# EAGLE design Adafruit PiTFT 2.8inch Resistive PCB (EAGLE 6.3)
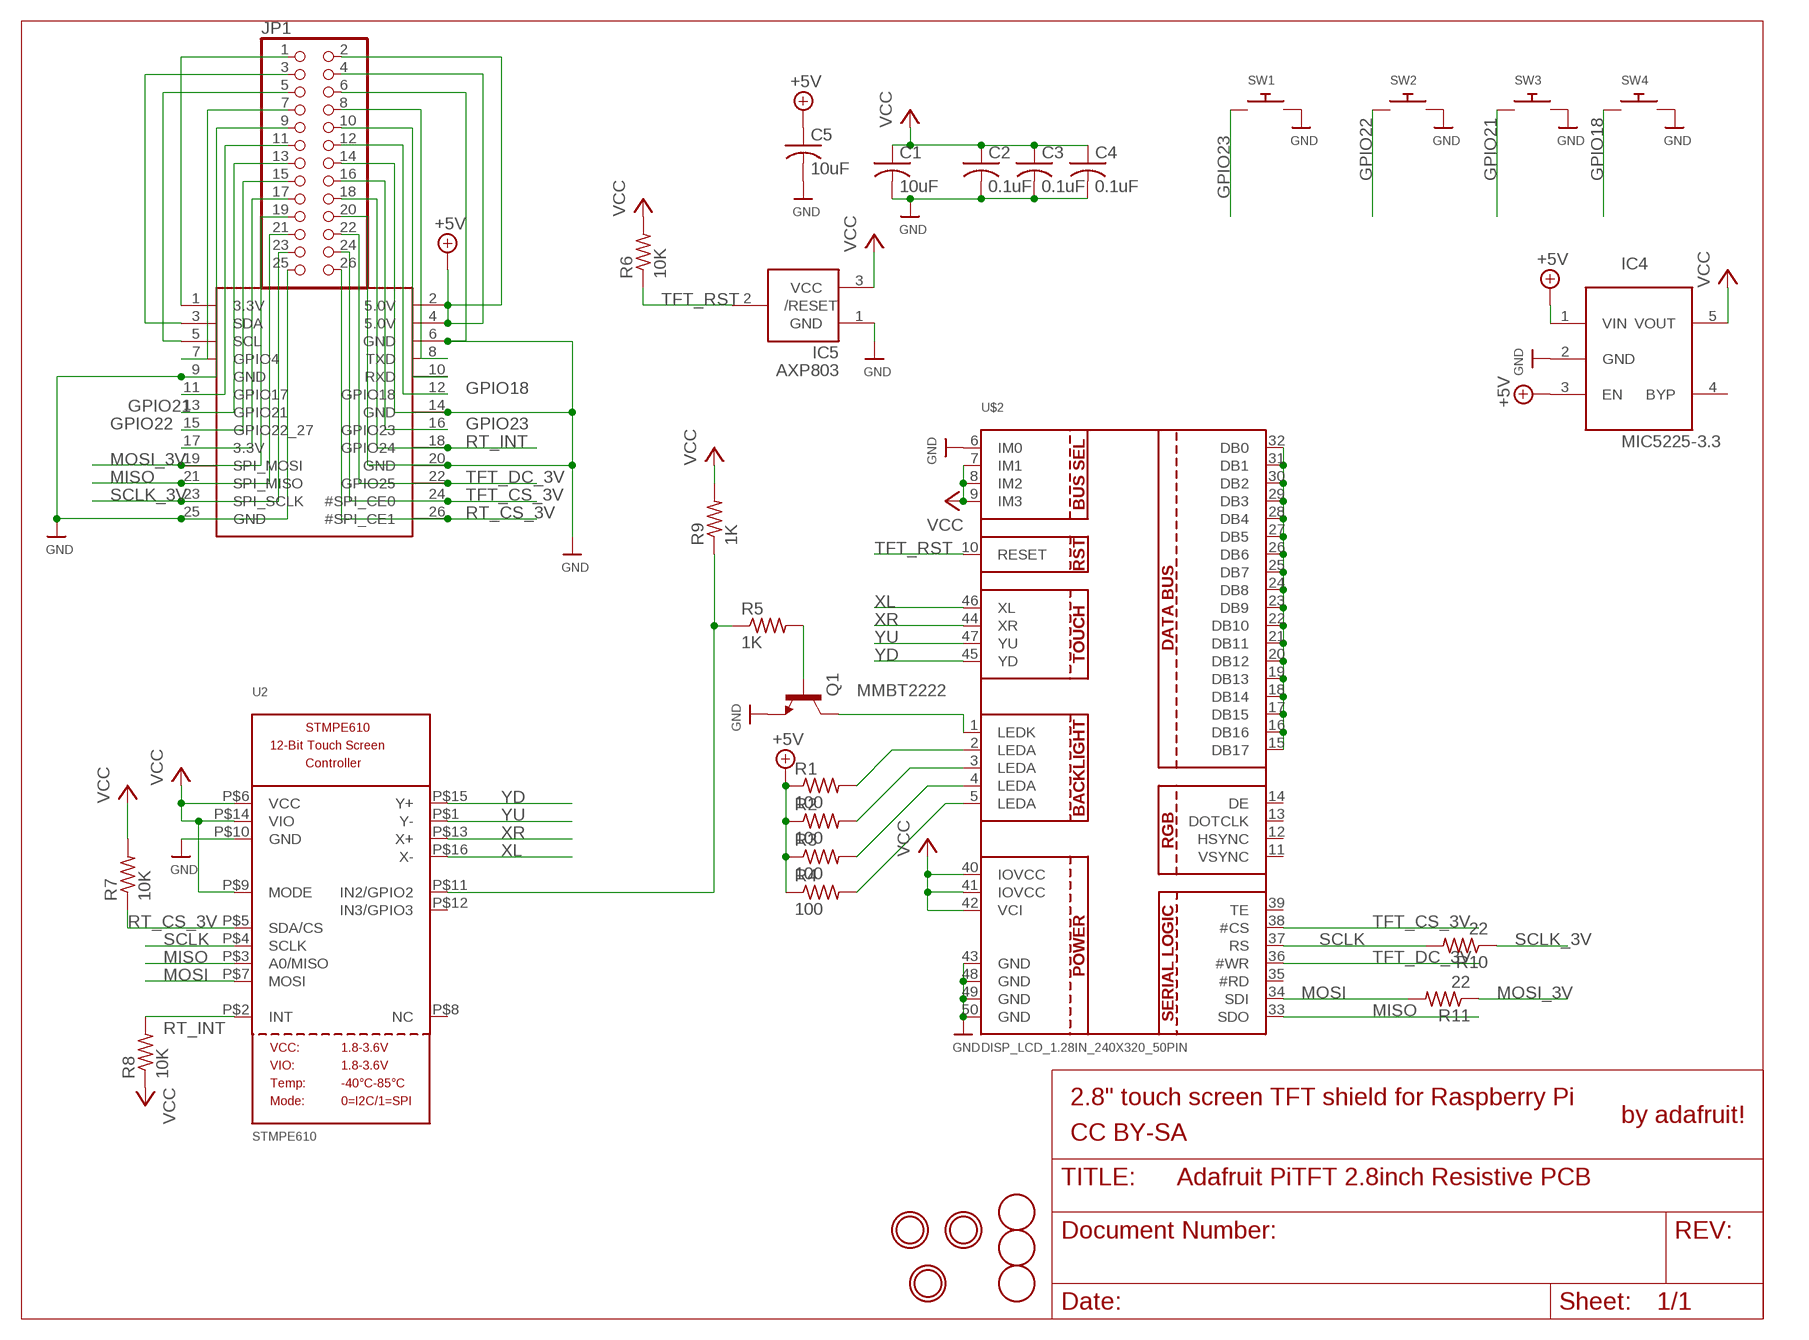
[diagram p0: schematic, sheet 1]

## Parts
C1  10uF  C-USC0805K  [C0805K]
C2  0.1uF  C-USC0805K  [C0805K]
C3  0.1uF  C-USC0805K  [C0805K]
C4  0.1uF  C-USC0805K  [C0805K]
C5  10uF  C-USC0805K  [C0805K]
IC4  MIC5225-3.3  LP298XS  [SOT23-5L]
IC5  AXP803  AXP083-SAG  [SOT23]
JP1  HEADER-2X13  [2X13]
Q1  MMBT2222  MMBT2222ALT1-NPN-SOT23-BEC  [SOT23-BEC]
R1  100  R-US_R0805  [R0805]
R2  100  R-US_R0805  [R0805]
R3  100  R-US_R0805  [R0805]
R4  100  R-US_R0805  [R0805]
R5  1K  R-US_R0805  [R0805]
R6  10K  R-US_R0805  [R0805]
R7  10K  R-US_R0805  [R0805]
R8  10K  R-US_R0805  [R0805]
R9  1K  R-US_R0805  [R0805]
R10  22  R-US_R0805  [R0805]
R11  22  R-US_R0805  [R0805]
SW1  SWITCH_PUSHBUTTONEVQ-PE  [TACT_PANA-EVQ]
SW2  SWITCH_PUSHBUTTONEVQ-PE  [TACT_PANA-EVQ]
SW3  SWITCH_PUSHBUTTONEVQ-PE  [TACT_PANA-EVQ]
SW4  SWITCH_PUSHBUTTONEVQ-PE  [TACT_PANA-EVQ]
U2  STMPE610  [QFN16_3MM]
U$2  DISP_LCD_1.28IN_240X320_50PIN  [TFT_2.83IN_240X320_50PIN]
U$3  RASPBERRYPI_B_MODELB_V2  [RASPBERRYPIV2_SHIELD]
U$10  FIDUCIAL  [FIDUCIAL_1MM]
U$11  FIDUCIAL  [FIDUCIAL_1MM]
U$15  MOUNTINGHOLE2.5_THICK  [MOUNTINGHOLE_2.5_PLATED_THICK]
U$16  MOUNTINGHOLE2.5_THICK  [MOUNTINGHOLE_2.5_PLATED_THICK]
U$17  MOUNTINGHOLE2.5_THICK  [MOUNTINGHOLE_2.5_PLATED_THICK]
U$18  FIDUCIAL  [FIDUCIAL_1MM]

## Nets
3.3V: JP1.1 U$3.1(3.3V)
3.3V@2: JP1.17 U$3.17(3.3V)
+5V: C5.1 IC4.1(VIN) IC4.3(EN) JP1.2 JP1.4 R1.1 R2.1 R3.1 R4.1 U$3.2(5.0V) U$3.4(5.0V)
GND: C1.2 C2.2 C3.2 C4.2 C5.2 IC4.2(GND) IC5.1(GND) JP1.6 JP1.9 JP1.14 JP1.20 JP1.25 Q1.E SW1.P$2 SW2.P$2 SW3.P$2 SW4.P$2 U2.P$10(GND) U$2.6(IM0) U$2.43(GND) U$2.48(GND) U$2.49(GND) U$2.50(GND) U$3.6(GND) U$3.9(GND) U$3.14(GND) U$3.20(GND) U$3.25(GND)
GPIO18: JP1.12 SW4.P$1 U$3.12(GPIO18)
GPIO21: JP1.13 SW3.P$1 U$3.13(GPIO21)
GPIO22: JP1.15 SW2.P$1 U$3.15(GPIO22_27)
GPIO23: JP1.16 SW1.P$1 U$3.16(GPIO23)
MISO: JP1.21 U2.P$3(A0/MISO) U$2.33(SDO) U$3.21(SPI_MISO)
MOSI: R11.2 U2.P$7(MOSI) U$2.34(SDI)
MOSI_3V: JP1.19 R11.1 U$3.19(SPI_MOSI)
N$1: Q1.C U$2.1(LEDK)
N$2: R1.2 U$2.2(LEDA)
N$3: R2.2 U$2.3(LEDA)
N$4: R3.2 U$2.4(LEDA)
N$5: R5.1 R9.1 U2.P$11(IN2/GPIO2)
N$6: JP1.3 U$3.3(SDA)
N$7: JP1.5 U$3.5(SCL)
N$8: JP1.7 U$3.7(GPIO4)
N$9: U$2.15(DB17) U$2.16(DB16) U$2.17(DB15) U$2.18(DB14) U$2.19(DB13) U$2.20(DB12) U$2.21(DB11) U$2.22(DB10) U$2.23(DB9) U$2.24(DB8) U$2.25(DB7) U$2.26(DB6) U$2.27(DB5) U$2.28(DB4) U$2.29(DB3) U$2.30(DB2) U$2.31(DB1) U$2.32(DB0)
N$10: R4.2 U$2.5(LEDA)
N$11: JP1.11 U$3.11(GPIO17)
N$16: Q1.B R5.2
N$17: JP1.10 U$3.10(RXD)
N$18: JP1.8 U$3.8(TXD)
RT_CS_3V: JP1.26 R7.1 U2.P$5(SDA/CS) U$3.26(#SPI_CE1)
RT_INT: JP1.18 R8.2 U2.P$2(INT) U$3.18(GPIO24)
SCLK: R10.2 U2.P$4(SCLK) U$2.37(RS)
SCLK_3V: JP1.23 R10.1 U$3.23(SPI_SCLK)
TFT_CS_3V: JP1.24 U$2.38(#CS) U$3.24(#SPI_CE0)
TFT_DC_3V: JP1.22 U$2.36(#WR) U$3.22(GPIO25)
TFT_RST: IC5.2(/RESET) R6.1 U$2.10(RESET)
VCC: C1.1 C2.1 C3.1 C4.1 IC4.5(VOUT) IC5.3(VCC) R6.2 R7.2 R8.1 R9.2 U2.P$6(VCC) U2.P$9(MODE) U2.P$14(VIO) U$2.7(IM1) U$2.8(IM2) U$2.9(IM3) U$2.40(IOVCC) U$2.41(IOVCC) U$2.42(VCI)
XL: U2.P$16(X-) U$2.46(XL)
XR: U2.P$13(X+) U$2.44(XR)
YD: U2.P$15(Y+) U$2.45(YD)
YU: U2.P$1(Y-) U$2.47(YU)
Unconnected: IC4.4(BYP) U2.P$8(NC) U2.P$12(IN3/GPIO3) U$2.11(VSYNC) U$2.12(HSYNC) U$2.13(DOTCLK) U$2.14(DE) U$2.35(#RD) U$2.39(TE)

## Notes on the sheet
- 2.8" touch screen TFT shield for Raspberry Pi
- by adafruit!
- CC BY-SA

## Library data of the parts
C1-C5 = adafruit:C-US: CAPACITOR, American symbol
IC4 = adafruit:LP298X
IC5 = adafruit:AXP083
JP1 = microbuilder:HEADER-2X13
Q1 = transistor-neu-to92:*-NPN-: NPN Transistror
R1-R11 = rcl:R-US_: RESISTOR, American symbol
SW1-SW4 = microbuilder:SWITCH_PUSHBUTTON: Buttons SOFTTOUCHSMD_SJ - Soft touch temporary push button (Super Junk Akihabara) Compatible with SKPMANE010 [Mouser: 688-SKPMAN]
U2 = microbuilder:STMPE610: STMPE610 - 12-Bit Touch Screen Controller
U$2 = microbuilder:DISP_LCD_1.28IN_240X320_50PIN
U$3 = microbuilder:RASPBERRYPI_B
U$10 U$11 U$18 = adafruit:FIDUCIAL: For use by pick and place machines to calibrate the vision/machine, 1mm By microbuilder.eu
U$15-U$17 = microbuilder:MOUNTINGHOLE: Mounting Hole For #2 screws (0.086"/2.18mm width, 0.094"/2.4mm hole) use 2.5mm; BOM: EXCLUDE

## Board
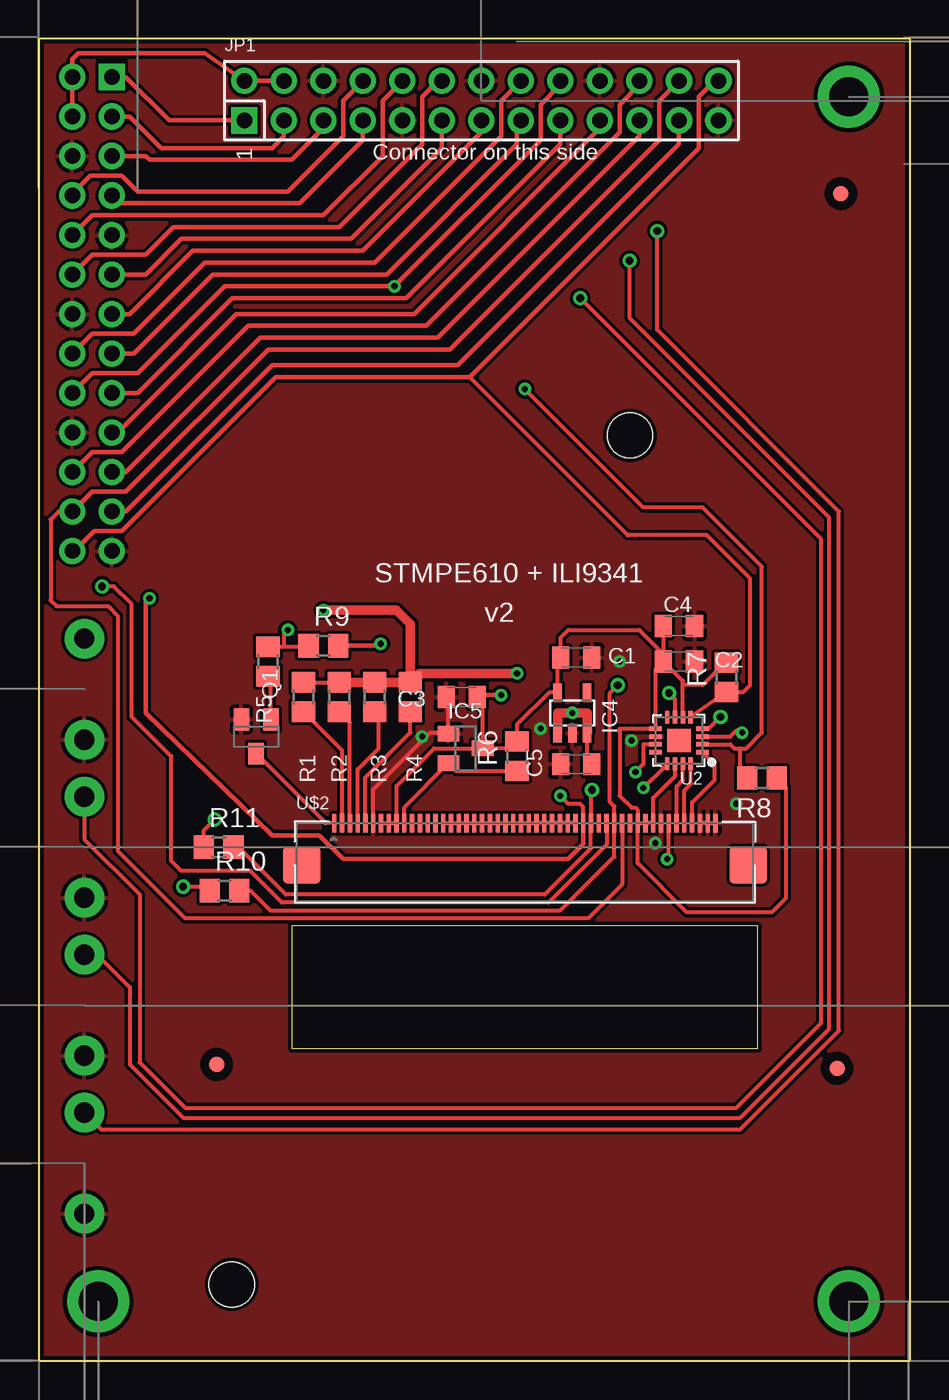
[diagram p1: board, top side]
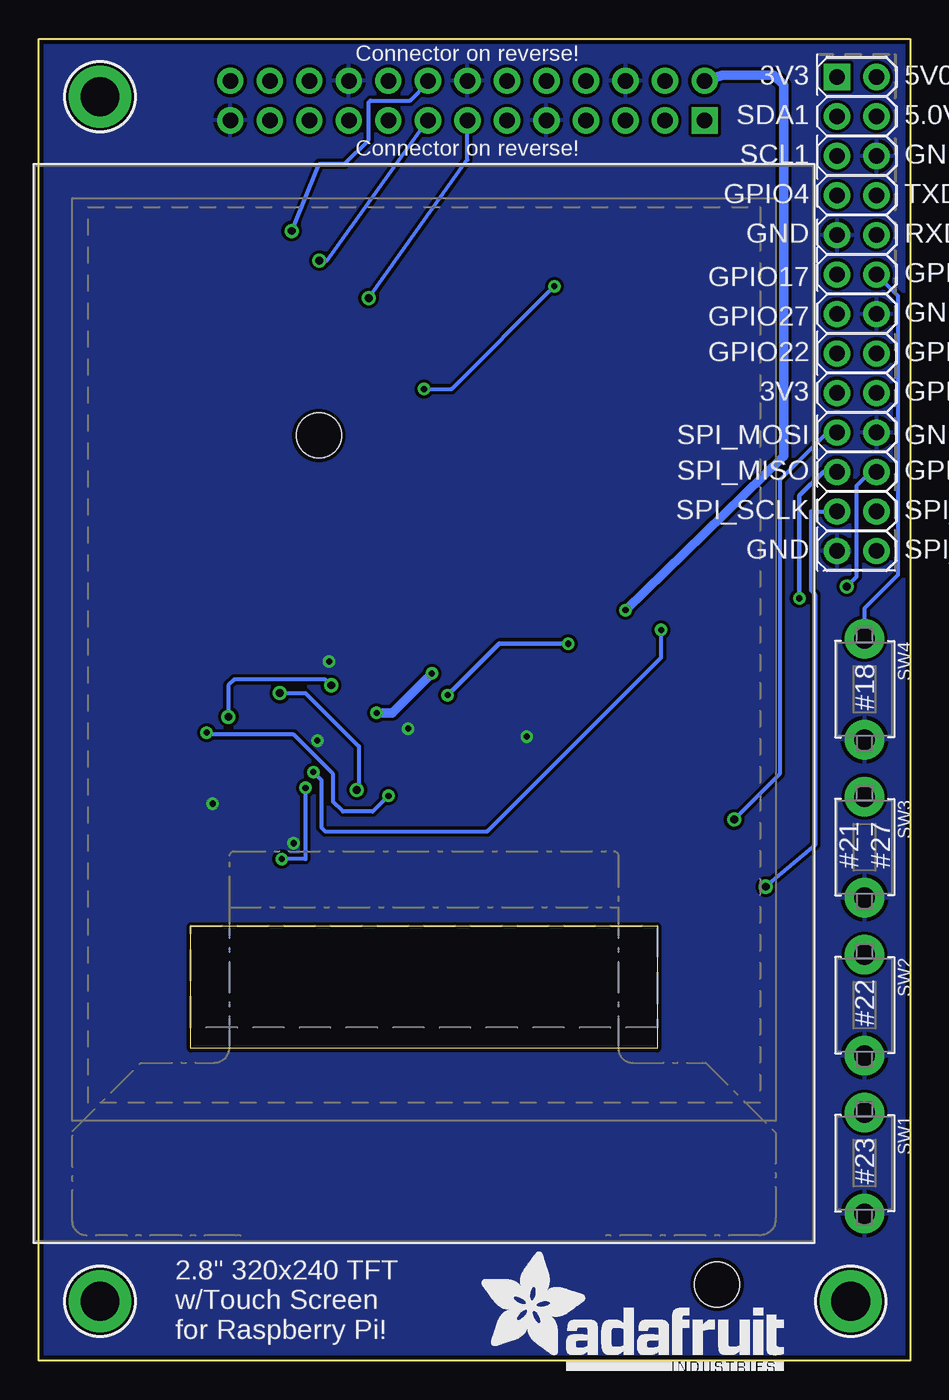
[diagram p2: board, bottom side, seen from below]

Size 56 x 85 mm. Coordinates in mm from the lower left corner, seen from the top.
Outline: 46.23,27.94 16.26,27.94 16.26,20.07 46.23,20.07 46.23,27.94
Copper layers (1*16): Top 0.035mm / dielectric 1.5mm / Bottom 0.035mm
Design rules "adafruit *": minimum track width 8mil, minimum drill 15.5mil, track to track 8mil, track to pad 8mil, pad to pad 8mil, via to via 8mil, smd to smd 8mil, copper to edge 10mil, drill to drill 8mil, minimum pad ring 10mil, minimum via ring 8mil, stop-mask expansion 4mil, vias tented up to drill 20mil, thermal gap 10mil

### Footprints (pad centres in the part's own frame; a part is rotated, then mirrored left to right if it is on the bottom)
C0805K = smd 1.1 x 1.4: 1 -1,0; 2 1,0
SOT23-5L = smd 0.55 x 1.2: 1 -0.95,-1.3; 2 0,-1.3; 3 0.95,-1.3; 4 0.95,1.3; 5 -0.95,1.3
SOT23 = smd 1 x 1.4: 1 -0.95,-1.1; 2 0.95,-1.1; 3 0,1.1
2X13 = drill 1 pad 1.676 square: 1 -15.24,-1.27 | drill 1 pad 1.676: 2 -15.24,1.27; 3 -12.7,-1.27; 4 -12.7,1.27; 5 -10.16,-1.27; 6 -10.16,1.27; 7 -7.62,-1.27; 8 -7.62,1.27; 9 -5.08,-1.27; 10 -5.08,1.27; 11 -2.54,-1.27; 12 -2.54,1.27; 13 0,-1.27; 14 0,1.27; 15 2.54,-1.27; 16 2.54,1.27; 17 5.08,-1.27; 18 5.08,1.27; 19 7.62,-1.27; 20 7.62,1.27; 21 10.16,-1.27; 22 10.16,1.27; 23 12.7,-1.27; 24 12.7,1.27; 25 15.24,-1.27; 26 15.24,1.27
SOT23-BEC = smd 1 x 1.4: B -0.95,-1.1; C 0,1.1; E 0.95,-1.1
R0805 = smd 1.3 x 1.5: 1 -0.95,0; 2 0.95,0
TACT_PANA-EVQ = drill 1.3 pad 2.54: P$1 -3.25,0; P$2 3.25,0
QFN16_3MM = smd 0.8 x 0.28: P$1 -1.5,0.75; P$2 -1.5,0.25; P$3 -1.5,-0.25; P$4 -1.5,-0.75; P$9 1.5,-0.75; P$10 1.5,-0.25; P$11 1.5,0.25; P$12 1.5,0.75 | smd 0.28 x 0.8: P$5 -0.75,-1.5; P$6 -0.25,-1.5; P$7 0.25,-1.5; P$8 0.75,-1.5; P$13 0.75,1.5; P$14 0.25,1.5; P$15 -0.25,1.5; P$16 -0.75,1.5 | smd 1.5 x 1.5: THERMAL 0,0
TFT_2.83IN_240X320_50PIN = smd 0.275 x 1.2 bottom: 1 12.25,-10.39; 2 11.75,-10.39; 3 11.25,-10.39; 4 10.75,-10.39; 5 10.25,-10.39; 6 9.75,-10.39; 7 9.25,-10.39; 8 8.75,-10.39; 9 8.25,-10.39; 10 7.75,-10.39; 11 7.25,-10.39; 12 6.75,-10.39; 13 6.25,-10.39; 14 5.75,-10.39; 15 5.25,-10.39; 16 4.75,-10.39; 17 4.25,-10.39; 18 3.75,-10.39; 19 3.25,-10.39; 20 2.75,-10.39; 21 2.25,-10.39; 22 1.75,-10.39; 23 1.25,-10.39; 24 0.75,-10.39; 25 0.25,-10.39; 26 -0.25,-10.39; 27 -0.75,-10.39; 28 -1.25,-10.39; 29 -1.75,-10.39; 30 -2.25,-10.39; 31 -2.75,-10.39; 32 -3.25,-10.39; 33 -3.75,-10.39; 34 -4.25,-10.39; 35 -4.75,-10.39; 36 -5.25,-10.39; 37 -5.75,-10.39; 38 -6.25,-10.39; 39 -6.75,-10.39; 40 -7.25,-10.39; 41 -7.75,-10.39; 42 -8.25,-10.39; 43 -8.75,-10.39; 44 -9.25,-10.39; 45 -9.75,-10.39; 46 -10.25,-10.39; 47 -10.75,-10.39; 48 -11.25,-10.39; 49 -11.75,-10.39; 50 -12.25,-10.39 | smd 2.4 x 2.4 bottom: PAD1 14.35,-13.09; PAD2 -14.35,-13.09
RASPBERRYPIV2_SHIELD = drill 1 pad 1.676 square: 1 -4.692,82.55 | drill 1 pad 1.676: 2 -2.152,82.55; 3 -4.692,80.01; 4 -2.152,80.01; 5 -4.692,77.47; 6 -2.152,77.47; 7 -4.692,74.93; 8 -2.152,74.93; 9 -4.692,72.39; 10 -2.152,72.39; 11 -4.692,69.85; 12 -2.152,69.85; 13 -4.692,67.31; 14 -2.152,67.31; 15 -4.692,64.77; 16 -2.152,64.77; 17 -4.692,62.23; 18 -2.152,62.23; 19 -4.692,59.69; 20 -2.152,59.69; 21 -4.692,57.15; 22 -2.152,57.15; 23 -4.692,54.61; 24 -2.152,54.61; 25 -4.692,52.07; 26 -2.152,52.07 | hole 2.9: -38,59.5; -12.4,4.9
FIDUCIAL_1MM = smd 1 x 1: 1 0,0
MOUNTINGHOLE_2.5_PLATED_THICK = drill 2.5 pad 4: P$1 0,0

### Placement (x,y rotation side)
C1  34.54,45.21 0 top
C2  41.15,44.96 0 top
C3  27.18,42.67 180 top
C4  41.15,47.24 0 top
C5  34.54,38.35 180 top
IC4  34.29,41.66 0 top
IC5  27.43,39.37 270 top
JP1  28.45,81.03 0 top
Q1  13.97,40.13 180 top
R1  17.02,42.67 270 top
R2  19.3,42.67 270 top
R3  21.59,42.67 270 top
R4  23.88,42.67 270 top
R5  14.73,44.96 270 top
R6  30.73,38.86 90 top
R7  44.2,43.94 90 top
R8  46.48,37.47 180 top
R9  18.29,45.97 0 top
R10  11.94,30.23 0 top
R11  11.56,33.02 0 top
SW1  2.92,12.7 270 bottom
SW2  2.92,22.86 270 bottom
SW3  2.92,33.02 270 bottom
SW4  2.92,43.18 270 bottom
U2  41.15,39.88 180 top
U$2  31.24,44.96 0 bottom
U$3  0,0 0 bottom
U$10  51.31,18.8 90 top
U$11  11.43,19.05 180 top
U$15  3.81,3.81 90 bottom
U$16  52.07,81.28 90 bottom
U$17  52.07,3.81 0 bottom
U$18  51.56,75.06 0 top
U$23  [ADAFRUIT_TEXT_20MM]  27.69,-0.64 0 bottom

### Tracks (layer width: path | path; a pad name or v marks a point on that pad's centre or on a via)
3.3V
  Top 0.305: U$3.1 5.59,82.55 8.38,79.76 JP1.1
3.3V@2
  Top 0.305: U$3.17 6.35,62.23 12.45,68.33 23.62,68.33 33.53,78.23 JP1.17
+5V  (via drill 0.39)
  Top 0.254: R1.1 R2.1 19.24,43.69 | C5.1 35.24,38.66 IC4.3
  Top 0.305: U$3.2 U$3.4 2.15,83.69 2.54,84.07 10.67,84.07 JP1.2 JP1.4
  Top 0.61: R2.1 R3.1 R4.1 | IC4.1 33.34,41.66 v34.29,41.66 35.24,41.66 IC4.3 | R4.1 24.45,44.2 v30.73,44.2 | v18.29,48.26 22.99,48.26 23.88,47.37 R4.1
  Bottom 0.61: v30.73,44.2 33.27,41.66 v34.29,41.66 | v18.29,48.26 8.13,58.17 8.13,82.04 8.76,82.68 12.06,82.68 JP1.2
GND  (via drill 0.39)
  Top 0.254: U$2.6 21.49,36.73 25.15,40.39 26.27,40.39 IC5.1 26.33,42.67 C3.2 | U$2.48 U$2.49 U$2.50
  other vias: 39.62,33.27 32.26,40.64 37.34,44.96 38.1,39.88 24.64,40.13 44.83,35.81
  pour Top: 55.88,0 0,0 0,85.09 55.88,85.09
  pour Bottom: 55.88,0 0,0 0,85.09 55.88,85.09
GPIO18
  Top 0.305: U$3.12 3.42,71.12 6.86,71.12 8.64,72.9 19.3,72.9 24.64,78.23 24.64,81.28 25.65,82.3 JP1.12
  Bottom 0.254: SW4.P$1 2.92,48.39 0.76,50.55 0.76,68.46 U$3.12
GPIO21  (via drill 0.5)
  Top 0.254: SW3.P$1 2.92,33.53 6.48,29.97 6.48,19.18 9.4,16.26 44.83,16.26 50.29,21.72 50.29,52.83 v34.8,68.33
  Top 0.305: U$3.13 5.84,67.31 9.91,71.37 20.83,71.37 28.45,78.99 JP1.13
  Bottom 0.254: v34.8,68.33 28.45,77.22 JP1.13
GPIO22  (via drill 0.5)
  Top 0.254: SW2.P$1 3.73,26.11 5.84,24 5.84,19.05 9.27,15.62 45.09,15.62 50.8,21.34 50.8,54.23 37.97,67.06 v37.97,70.74
  Top 0.305: U$3.15 6.1,64.77 11.18,69.85 22.35,69.85 30.73,78.23 30.73,79.5 JP1.15
  Bottom 0.254: v37.97,70.74 37.47,70.74 JP1.15
GPIO23  (via drill 0.5)
  Top 0.254: SW1.P$1 4.01,14.86 45.09,14.86 51.44,21.21 51.44,54.61 39.75,66.29 v39.75,72.64
  Top 0.305: U$3.16 3.42,66.04 6.1,66.04 10.67,70.61 21.59,70.61 29.72,78.74 29.72,81.03 JP1.16
  Bottom 0.254: v39.75,72.64 37.97,76.96 36.32,76.96 34.8,78.49 34.8,80.9 34.67,81.03 32.13,81.03 30.99,82.17 JP1.16
MISO  (via drill 0.39)
  Top 0.254: U2.P$3 44.45,40.13 44.83,40.51 v45.21,40.39 | U$2.33 34.99,35.62 34.8,35.81 34.04,35.81 v33.53,36.32
  Top 0.305: U$3.21 5.59,57.15 14.22,65.79 25.65,65.79 38.61,78.74 JP1.21 | U$2.33 34.99,33.21 34.04,32.26 19.56,32.26 18.03,33.78 14.99,33.78 6.86,41.66 6.86,48.77 v7.11,49.02
  Bottom 0.254: v33.53,36.32 34.54,35.31 36.45,35.31 37.08,35.94 37.08,37.72 39.62,40.26 45.09,40.26 v45.21,40.39
  Bottom 0.305: v7.11,49.02 7.11,55.63 5.59,57.15 U$3.21
MOSI  (via drill 0.5)
  Top 0.254: U2.P$7 40.9,42.54 v40.51,42.93 | v35.56,36.7 35.49,36.63 U$2.34 35.49,32.95 32.51,29.97 15.88,29.97 12.83,33.02 R11.2
  Bottom 0.254: v40.51,42.93 38.86,42.93 35.43,39.5 35.43,36.83 v35.56,36.7
MOSI_3V  (via drill 0.5)
  Top 0.254: R11.1 10.61,34.1 v11.3,34.8
  Top 0.305: U$3.19 4.69,59.3 12.7,67.31 24.13,67.31 36.07,79.25 JP1.19
  Bottom 0.254: U$3.19 5.33,59.69 8.38,56.64 8.38,37.72 v11.3,34.8
N$1
  Top 0.254: U$2.1 18.43,34.57 Q1.C
N$2
  Top 0.254: U$2.2 19.49,39.25 R1.2
N$3
  Top 0.254: U$2.3 19.99,41.03 R2.2
N$4
  Top 0.254: U$2.4 20.49,38.02 21.84,39.37 21.84,41.47 R3.2
N$5  (via drill 0.39)
  Top 0.254: R5.1 15.75,45.91 | 15.75,45.91 17.27,45.91 R9.1 | U2.P$11 38.86,39.63 38.86,38.35 v38.35,37.85 | v16,46.99 15.75,46.74 15.75,45.91
  Bottom 0.254: v38.35,37.85 37.85,37.34 37.85,34.29 37.59,34.04 27.18,34.04 16,45.21 v16,46.99
N$6
  Top 0.305: U$3.3 5.84,80.01 7.87,77.98 14.99,77.98 15.75,78.74 JP1.3
N$7
  Top 0.305: JP1.5 18.29,79.25 16.26,77.22 7.11,77.22 6.86,77.47 U$3.5
N$8
  Top 0.305: JP1.7 20.83,78.49 16.76,74.42 5.2,74.42 U$3.7
N$9
  Top 0.254: U$2.32 U$2.31 U$2.30 U$2.29 U$2.28 U$2.27 U$2.26 U$2.25 U$2.24 U$2.23 U$2.22 U$2.21 U$2.20 U$2.19 U$2.18 U$2.17 U$2.16 U$2.15
N$10
  Top 0.254: U$2.5 20.99,37.5 23.88,40.39 R4.2
N$11
  Top 0.305: U$3.11 6.86,69.85 9.14,72.14 20.07,72.14 25.91,77.98 JP1.11
N$16
  Top 0.254: Q1.B 14.92,43.82 R5.2
N$17
  Top 0.305: U$3.10 3.42,73.66 18.29,73.66 22.1,77.47 22.1,81.03 JP1.10
N$18
  Top 0.305: U$3.8 2.15,75.05 3.3,76.2 5.33,76.2 6.35,75.18 16,75.18 19.56,78.74 19.56,81.03 JP1.8
RT_CS_3V
  Top 0.254: U2.P$5 R7.1 45.28,42.99 45.72,43.43 45.72,50.29 42.93,53.09 37.85,53.09 27.69,63.25
  Top 0.305: U$3.26 2.29,52.07 3.56,53.34 5.33,53.34 15.24,63.25 27.69,63.25 42.42,77.98 42.42,81.28 43.43,82.3 JP1.26
RT_INT  (via drill 0.39)
  Top 0.254: U2.P$2 44.45,39.63 44.7,39.37 45.09,39.37 | 45.09,39.37 45.47,39.37 46.48,40.39 46.48,51.05 42.67,54.86 38.86,54.86 v31.24,62.48 | R8.2 45.09,37.47 45.09,39.37
  Top 0.305: U$3.18 3.42,63.5 6.35,63.5 11.94,69.09 v22.86,69.09 32.26,78.49 32.26,80.77 33.53,82.04 JP1.18
  Bottom 0.254: v31.24,62.48 29.46,62.48 v22.86,69.09
SCLK  (via drill 0.5)
  Top 0.254: R10.2 13.59,30.23 14.86,28.96 33.53,28.96 36.99,32.42 U$2.37 36.99,35.65 36.7,35.94 36.7,42.93 v37.21,43.43 | v43.81,41.4 43.04,40.63 U2.P$4
  Bottom 0.254: v37.21,43.43 37.59,43.81 43.43,43.81 43.81,43.43 v43.81,41.4
SCLK_3V  (via drill 0.5)
  Top 0.254: 11.12,30.41 R10.1 10.86,30.48 v9.27,30.48
  Top 0.305: U$3.23 5.59,54.61 14.99,64.01 26.92,64.01 41.15,78.23 JP1.23
  Bottom 0.254: U$3.23 6.35,54.61 6.35,49.53 6.1,49.28 6.1,33.15 v9.27,30.48
TFT_CS_3V
  Top 0.254: U$2.38 37.49,30.63 35.31,28.45 9.4,28.45 5.08,32.77 5.08,47.88 4.45,48.51 1.14,48.51 0.76,48.9 0.76,54.1 1.27,54.61 U$3.24
  Top 0.305: U$3.24 3.42,55.88 5.59,55.88 14.73,65.02 26.42,65.02 39.88,78.49 39.88,81.03 JP1.24
TFT_DC_3V  (via drill 0.5)
  Top 0.254: U$2.36 36.49,33.19 32.77,29.46 15.62,29.46 13.59,31.5 9.14,31.5 8.51,32.13 8.51,38.86 5.97,41.4 5.97,48.64 4.83,49.78 v4.06,49.78
  Top 0.305: U$3.22 3.42,58.42 5.33,58.42 13.46,66.55 24.89,66.55 37.34,78.99 37.34,80.77 38.61,82.04 JP1.22
  Bottom 0.254: U$3.22 2.54,57.15 3.43,56.26 3.43,50.42 v4.06,49.78
TFT_RST
  Top 0.254: U$2.10 23.49,35.58 IC5.2 26.84,37.91 R6.1
VCC  (via drill 0.39)
  Top 0.254: U2.P$14 40.89,37.59 39.49,36.19 U$2.42 U$2.41 U$2.40 | U$2.7 U$2.8 U$2.9 22.99,36.96 25.4,39.37 IC5.3 | IC5.3 28.53,42.67 C3.1 | IC5.3 30.29,39.37 R6.2 30.73,40.89 32.8,42.96 IC4.5 33.34,45.01 C1.1 33.54,46.5 34.04,46.99 38.61,46.99 40.15,45.45 C2.1 | C2.1 39.65,44.46 U2.P$9 37.34,40.63 37.34,36.32 38.1,35.56 38.35,35.56 38.49,35.42 U$2.40 | U2.P$6 41.4,43.43 | 41.4,43.43 41.4,43.71 C2.1 | R7.2 44.13,44.89 42.67,43.43 41.4,43.43 | C4.1 C2.1 | R8.1 48.01,36.89 48.01,29.72 47.12,28.83 41.66,28.83 38.49,31.99 U$2.40
  Top 0.305: R9.2 21.84,45.97 v21.97,46.1 | v29.72,42.8 28.3,42.8 C3.1
  Bottom 0.305: v21.97,46.1 26.42,46.1 v29.72,42.8
XL
  Top 0.254: U$2.46 41.49,36.67 41.91,37.08 41.91,38.37 U2.P$16
XR  (via drill 0.39)
  Top 0.254: U2.P$13 40.16,38.12 v38.86,36.83 | v40.39,32.26 40.49,32.36 U$2.44
  Bottom 0.254: v38.86,36.83 38.86,32.26 v40.39,32.26
YD
  Top 0.254: U$2.45 40.99,36.93 41.4,37.34 U2.P$15
YU
  Top 0.254: U$2.47 41.99,35.9 43.43,37.34 43.43,38.34 U2.P$1

### Text on the board
tPlace: Connector on this side | 1 | STMPE610 + ILI9341 | v2
bPlace: Connector on reverse! | Connector on reverse! | #18 | #27 | #21 | #22 | #23 | 2.8" 320x240 TFT / w/Touch Screen / for Raspberry Pi!